# Altium schematic sheet RS232.SchDoc
size A; SheetNumber: 14; SheetTotal: 15
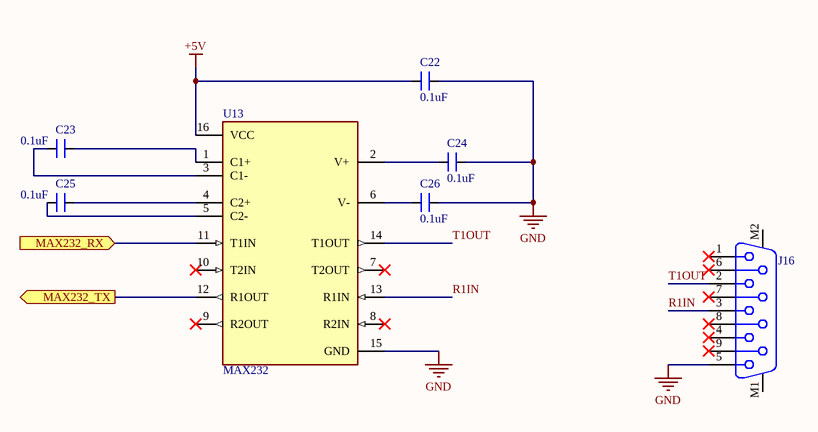
[diagram p0: RS232.SchDoc]

## Parts
C22  0.1uF  [CAP_0805]
C23  0.1uF  [CAP_0805]
C24  0.1uF  [CAP_0805]
C25  0.1uF  [CAP_0805]
C26  0.1uF  [CAP_0805]
J16  618009231121  [618009231121]  (value not drawn)
U13  MAX232  [FP-S16-3-IPC_A]

## Ports
MAX232_RX (in, see Block Diagram[3B]), MAX232_TX (out, see Block Diagram[3B])

## Nets
+5V: C22.2 U13.16(VCC)
GND: C22.1 C24.1 C26.1 J16.5 U13.15(GND)
MAX232_RX: U13.11(T1IN) ; port MAX232_RX
MAX232_TX: U13.12(R1OUT) ; port MAX232_TX
R1IN: J16.3 U13.13(R1IN)
T1OUT: J16.2 U13.14(T1OUT)
NetC23_1: C23.1 U13.3(C1-)
NetC23_2: C23.2 U13.1(C1+)
NetC24_2: C24.2 U13.2(V+)
NetC25_1: C25.1 U13.5(C2-)
NetC25_2: C25.2 U13.4(C2+)
NetC26_2: C26.2 U13.6(V-)

Not connected (* = marked no-connect by the designer): J16 1* 4* 6* 7* 8* 9* M1 M2; U13 7(T2OUT)* 8(R2IN)* 9(R2OUT)* 10(T2IN)*

## Library data of the parts
C22-C26 = CAP_0.1uF-50V-5%-0805: 0.1µF ±5% 50V Ceramic Capacitor X7R 0805 (2012 Metric); Manufacturer: AVX Corporation; Manufacturer Part Number: 08055C104JAT4A; Alternate Part Number-1: 0805B104M500; Case/Package: 0805; Supplier-1: SIRICOM; Supplier Part Number-1: 0805B104J500CT
J16 = DB-9_RIGHT-ANGLE: Female PCB Connector with Hex Screw WR-DSUB, 8.08 mm, Angled, 9 pins; Manufacturer: Wurth Elektronik; Contact Resistance: 30mOhm; Pin Number: 9; Working Voltage: 125VAC; Rated Current: 3A; Gender: Female; Datasheet URL: https://katalog.we-online.de/em/datasheet/6180xx231121.pdf; Packaging: Tray; Package Reference: 618009231121; Operating Temperature: -40to85degC; Manufacturer URL: http://www.we-online.de; Publisher: WurthElektronik; Mounting Technology: THT; Part Number: 618009231121; Orientation: Angled
U13 = MAX232CSE+T: IC RS-232 DRVR/RCVR 16-SOIC; Manufacturer: Maxim Integrated; Number Of Receivers: 2; Max Supply Voltage: 5.5V; Nominal Supply Current: 5mA; Simplex Duplex: Full Duplex; Min Supply Voltage: 4.5V; Data Rate: 120kbits/s; Standoff Height: 0.1mm; Device Class L1: Integrated Circuits (ICs); Device Class L2: Interface ICs; Package: S16-3; Temperature Range High: +70°C; ComponentLink2Description: Datasheet; Temperature: 0°C to +70°C; Octopart: https://octopart.com/max232cse%2Bt-maxim+integrated-39993384; ComponentLink2URL: https://datasheets.maximintegrated.com/en/ds/MAX220-MAX249.pdf; Manufacturer Part Number: MAX232CSE+T; Automotive: No; Device Class L3: RS-232 / RS-422 / RS-485 Interface ICs; Height: 1.75mm; Number Of Transmitters: 2; Digikey Description: IC RS-232 DRVR/RCVR 16-SOIC; Footprint Url: https://pdfserv.maximintegrated.com/land_patterns/90-0097.PDF; Temperature Range Low: 0°C; Mouser Description: RS-232 Interface IC 5V MultiCh RS-232 Driver/Receiver; Interface: RS-232; RoHS: TRUE; Lead Free: Yes; Category: IC